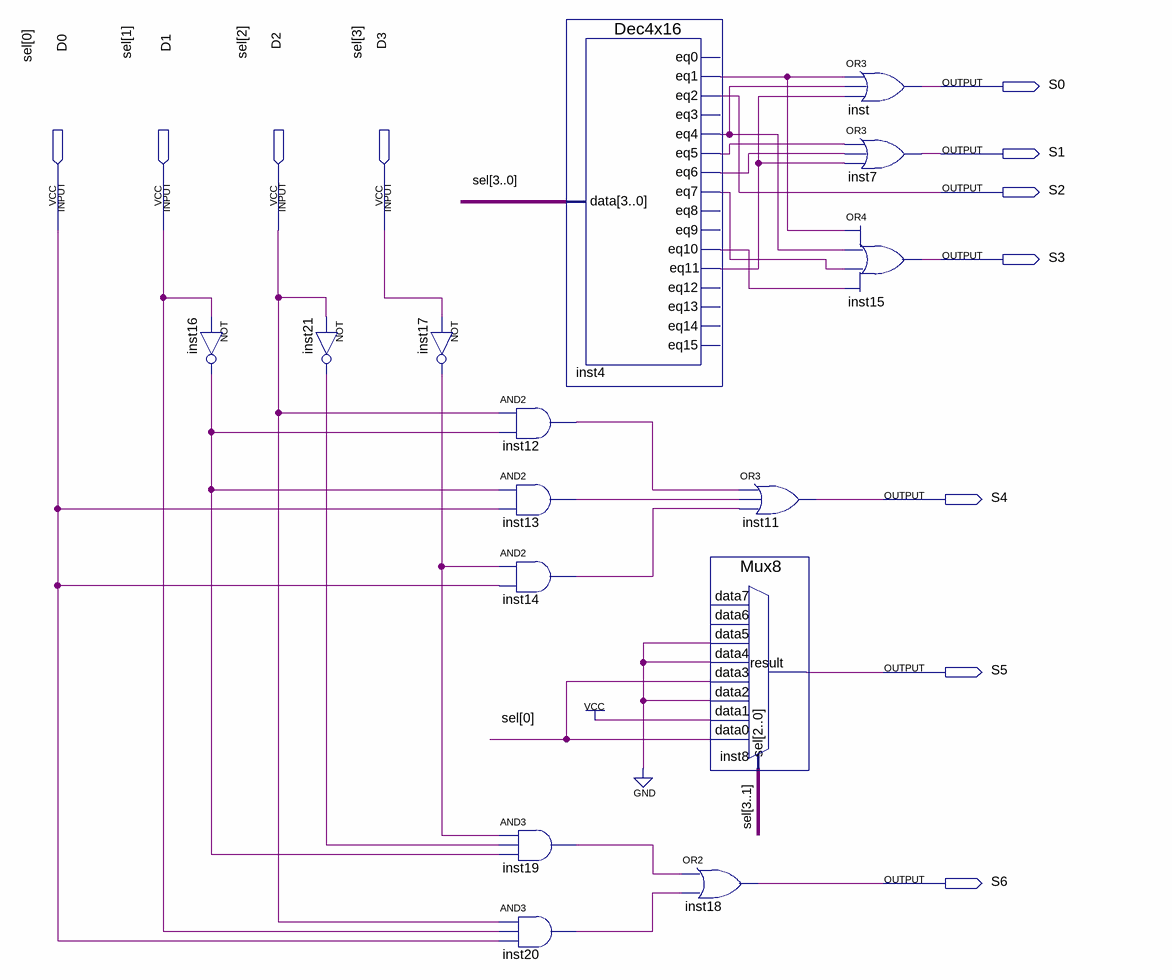
[diagram p0: schematic sheet]
// Quartus schematic Main.bdf as structural Verilog: 15 symbols, 11 pins
module Main (
  input  D0,
  input  D1,
  input  D2,
  input  D3,
  output S0,
  output S1,
  output S2,
  output S3,
  output S4,
  output S5,
  output S6
);

  wire inst4_eq1, inst4_eq4, inst4_eq5, inst4_eq6, inst4_eq7, inst4_eq10, inst4_eq11, inst12_out, inst13_out,
       inst14_out, inst16_out, inst17_out, inst19_out, inst20_out, inst21_out;

  not inst16 (inst16_out, D1);
  not inst21 (inst21_out, D2);
  not inst17 (inst17_out, D3);
  and inst12 (inst12_out, D2, inst16_out);
  and inst13 (inst13_out, inst16_out, D0);
  and inst14 (inst14_out, inst17_out, D0);
  and inst19 (inst19_out, inst17_out, inst21_out, inst16_out);
  and inst20 (inst20_out, D2, D1, D0);
  Dec4x16 inst4 (
    .data({D3, D2, D1, D0}), .eq1(inst4_eq1), .eq2(S2), .eq4(inst4_eq4), .eq5(inst4_eq5), .eq6(inst4_eq6),
    .eq7(inst4_eq7), .eq10(inst4_eq10), .eq11(inst4_eq11));  // open: eq0, eq3, eq8, eq9, eq12, eq13, eq14, eq15
  or inst18 (S6, inst19_out, inst20_out);
  or inst11 (S4, inst12_out, inst13_out, inst14_out);
  Mux8 inst8 (
    .data5(1'b0), .data4(1'b0), .data3(D0), .data2(1'b0), .data1(1'b1), .data0(D0), .sel({D3, D2, D1}),
    .result(S5));  // open: data7, data6
  or inst (S0, inst4_eq1, inst4_eq4, inst4_eq11);
  or inst7 (S1, inst4_eq5, inst4_eq6, inst4_eq11);
  or inst15 (S3, inst4_eq1, inst4_eq4, inst4_eq7, inst4_eq10);

  // Other names for the same wires on the sheet: sel[3:0] = {D3, D2, D1, D0}
endmodule
